# EAGLE design test1 (EAGLE 7.3.0)
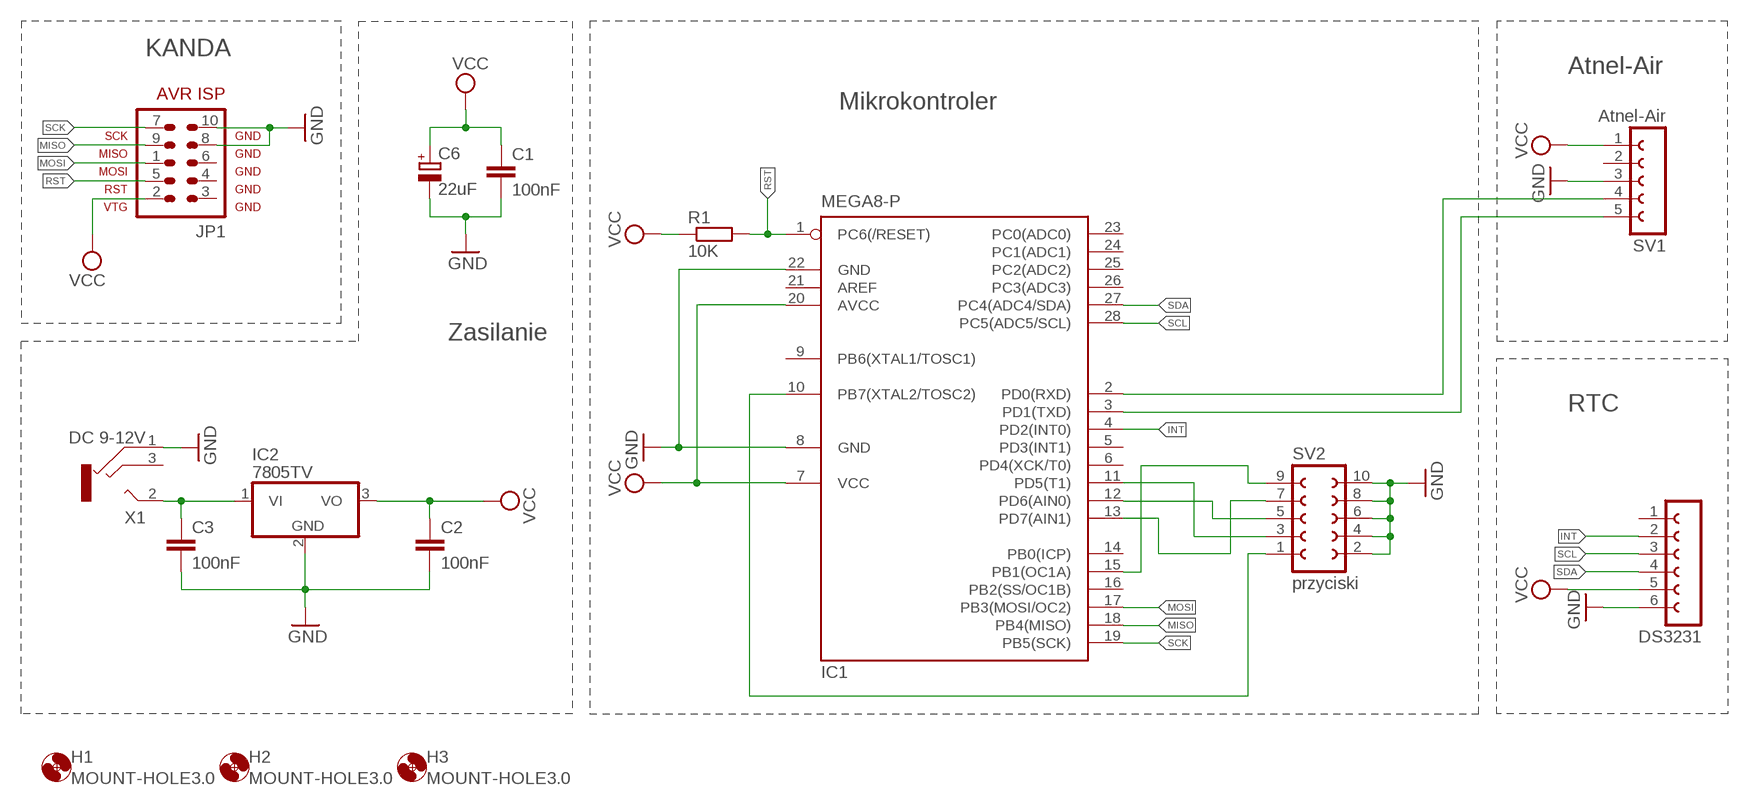
[diagram p0: schematic, sheet 1]

## Parts
C1  100nF  C-EU025-024X044  [C025-024X044]
C2  100nF  C-EU025-024X044  [C025-024X044]
C3  100nF  C-EU025-024X044  [C025-024X044]
C6  22uF  CPOL-EUB45181A  [B45181A]
DS3231  FE06-1  [FE06]
H1  MOUNT-HOLE3.0  [3,0]
H2  MOUNT-HOLE3.0  [3,0]
H3  MOUNT-HOLE3.0  [3,0]
IC1  MEGA8-P  [DIL28-3]
IC2  7805TV  [TO220V]
JP1  AVR-ISP-10  [AVR-ISP-10]
R1  10K  R-EU_0204/2V  [0204V]
SV1  Atnel-Air  FE05-1  [FE05-1]
SV2  przyciski  FE05-2  [FE05-2]
X1  DC 9-12V  1501_04  [1501_05]

## Nets
GND: C1.2 C2.2 C3.2 C6.- DS3231.6 IC1.8(GND) IC1.22(GND) IC2.2(GND) JP1.8 JP1.10 SV1.3 SV2.2 SV2.4 SV2.6 SV2.8 SV2.10 X1.1
INT: DS3231.2 IC1.4(PD2(INT0))
MISO: IC1.18(PB4(MISO)) JP1.9
MOSI: IC1.17(PB3(MOSI/OC2)) JP1.1
N$1: IC1.2(PD0(RXD)) SV1.4
N$2: IC1.3(PD1(TXD)) SV1.5
N$3: IC1.10(PB7(XTAL2/TOSC2)) SV2.1
N$4: IC1.13(PD7(AIN1)) SV2.7
N$5: IC1.12(PD6(AIN0)) SV2.5
N$6: C3.1 IC2.1(VI) X1.2
N$7: IC1.15(PB1(OC1A)) SV2.9
N$8: IC1.11(PD5(T1)) SV2.3
RST: IC1.1(PC6(/RESET)) JP1.5 R1.2
SCK: IC1.19(PB5(SCK)) JP1.7
SCL: DS3231.3 IC1.28(PC5(ADC5/SCL))
SDA: DS3231.4 IC1.27(PC4(ADC4/SDA))
VCC: C1.1 C2.1 C6.+ DS3231.5 IC1.7(VCC) IC1.20(AVCC) IC2.3(VO) JP1.2 R1.1 SV1.1
Unconnected: DS3231.1 IC1.5(PD3(INT1)) IC1.6(PD4(XCK/T0)) IC1.9(PB6(XTAL1/TOSC1)) IC1.14(PB0(ICP)) IC1.16(PB2(SS/OC1B)) IC1.21(AREF) IC1.23(PC0(ADC0)) IC1.24(PC1(ADC1)) IC1.25(PC2(ADC2)) IC1.26(PC3(ADC3)) JP1.3 JP1.4 JP1.6 SV1.2 X1.3

## Notes on the sheet
- KANDA
- Atnel-Air
- Mikrokontroler
- Zasilanie
- RTC

## Library data of the parts
C1-C3 = rcl:C-EU: CAPACITOR, European symbol
C6 = rcl:CPOL-EU: POLARIZED CAPACITOR, European symbol
DS3231 = con-lsta:FE06-1: FEMALE HEADER; OC_FARNELL: unknown; OC_NEWARK: unknown
H1-H3 = holes:MOUNT-HOLE: MOUNTING HOLE with drill center marker
IC1 = atmel:MEGA8-P: MICROCONTROLLER 8 Kbytes FLASH, 1 kbytes SRAM, 512 bytes EEPROM, USART, 4-channel 10 bit ADC, 2-channel 8 bit ADC Pin compatible with Atmega48, ATMega88, ATMega168 Source: avr.lbr; OC_FARNELL: unknown; OC_NEWARK: unknown
IC2 = linear:78*: Positive VOLTAGE REGULATOR Source: http://cache.national.com/ds/LM/LM78L05.pdf http://www.fairchildsemi.com/ds/LM/LM7805.pdf
JP1 = avr-5:AVR-ISP-10: AVR ISP-10 Serial Programming Header
R1 = resistor:R-EU_: RESISTOR, European symbol
SV1 = con-lsta:FE05-1: FEMALE HEADER; OC_FARNELL: unknown; OC_NEWARK: unknown
SV2 = con-lsta:FE05-2: FEMALE HEADER; OC_FARNELL: unknown; OC_NEWARK: unknown
X1 = con-lumberg:1501_0*: Jack connectors according to JISC 6560, 2.5 mm Klinkensteckverbinder nach JISC 6560, 2,5 mm Source: http://www.lumberg.com/Produkte/PDFs/1501_05.pdfedit 1501_03 http://www.lumberg.com/Produkte/PDFs/1501_06.pdf; OC_FARNELL: 1216977; OC_NEWARK: unknown

## Board
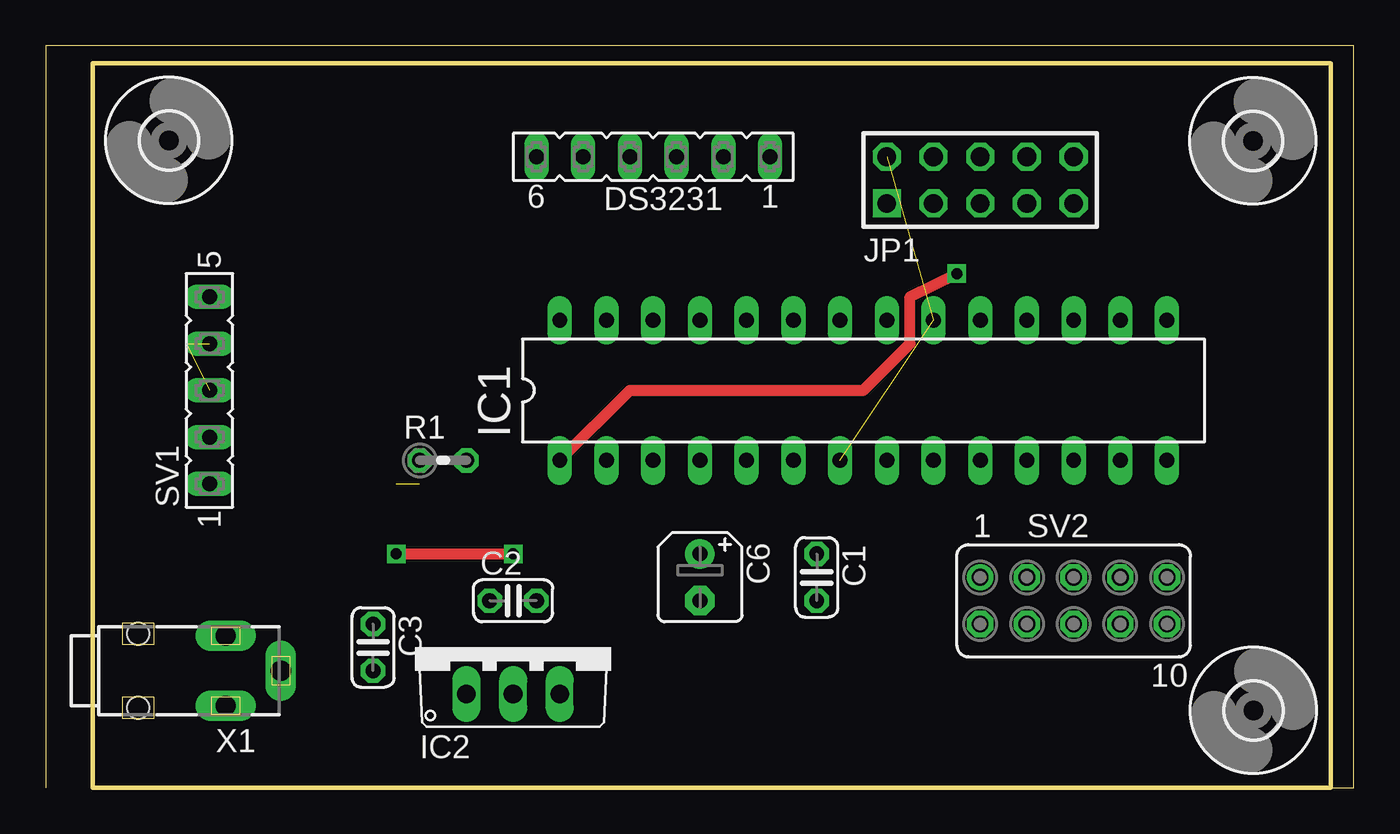
[diagram p1: board, top side]
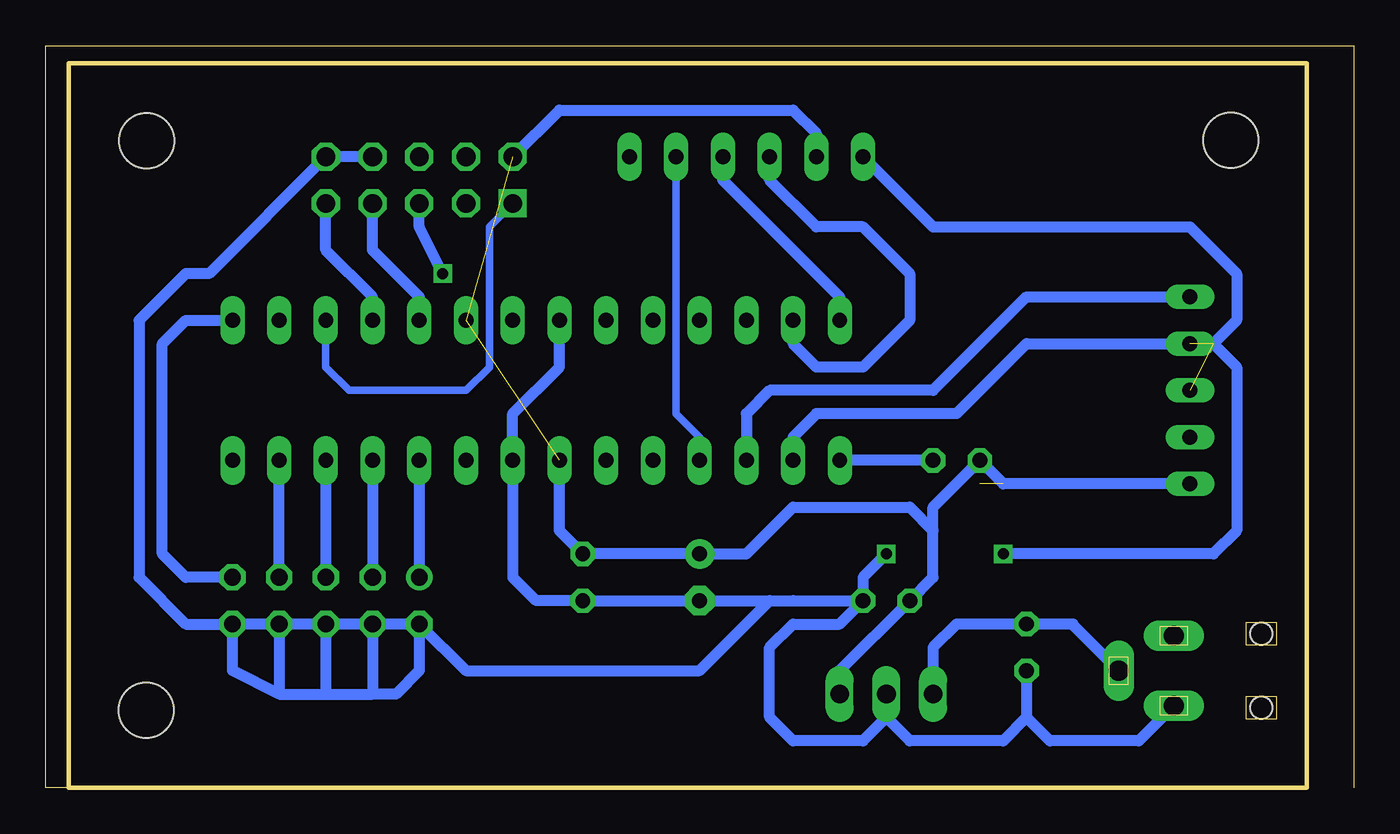
[diagram p2: board, bottom side, seen from below]

Size 71.1 x 40.31 mm. Coordinates in mm from the lower left corner, seen from the top.
Outline: 63.5,0 69.85,0
Outline: 69.85,0 71.1,0 71.1,40.31 0,40.31 0,0
Outline: 69.85,0 2.54,0 2.54,39.37 69.85,39.37 69.85,0
Copper layers (1*16): Top 0.035mm / dielectric 1.5mm / Bottom 0.035mm
Design rules "default": minimum track width 10mil, minimum drill 24mil, track to track 8mil, track to pad 8mil, pad to pad 8mil, via to via 8mil, smd to smd 8mil, copper to edge 40mil, drill to drill 8mil, minimum pad ring 10mil, minimum via ring 8mil, stop-mask expansion 4mil, vias tented up to drill 0mil, thermal gap 10mil

### Footprints (pad centres in the part's own frame; a part is rotated, then mirrored left to right if it is on the bottom)
C025-024X044 = drill 0.813 octagon: 1 -1.27,0; 2 1.27,0
B45181A = drill 0.813 pad 1.6: + -1.27,0 | drill 0.813 pad 1.6 octagon: - 1.27,0
FE06 = drill 0.813 long: 1 -6.35,0; 2 -3.81,0; 3 -1.27,0; 4 1.27,0; 5 3.81,0; 6 6.35,0
3,0 = hole 3: 0,0
DIL28-3 = drill 0.813 long: 1 -16.51,-3.81; 2 -13.97,-3.81; 3 -11.43,-3.81; 4 -8.89,-3.81; 5 -6.35,-3.81; 6 -3.81,-3.81; 7 -1.27,-3.81; 8 1.27,-3.81; 9 3.81,-3.81; 10 6.35,-3.81; 11 8.89,-3.81; 12 11.43,-3.81; 13 13.97,-3.81; 14 16.51,-3.81; 15 16.51,3.81; 16 13.97,3.81; 17 11.43,3.81; 18 8.89,3.81; 19 6.35,3.81; 20 3.81,3.81; 21 1.27,3.81; 22 -1.27,3.81; 23 -3.81,3.81; 24 -6.35,3.81; 25 -8.89,3.81; 26 -11.43,3.81; 27 -13.97,3.81; 28 -16.51,3.81
TO220V = drill 1.016 long: 1 -2.54,-2.54; 2 0,-2.54; 3 2.54,-2.54
AVR-ISP-10 = drill 1.016 square: 1 -5.08,-1.27 | drill 1.016 octagon: 2 -5.08,1.27; 3 -2.54,-1.27; 4 -2.54,1.27; 5 0,-1.27; 6 0,1.27; 7 2.54,-1.27; 8 2.54,1.27; 9 5.08,-1.27; 10 5.08,1.27
0204V = drill 0.813 octagon: 1 -1.27,0; 2 1.27,0
FE05-1 = drill 0.813 long: 1 -5.08,0; 2 -2.54,0; 3 0,0; 4 2.54,0; 5 5.08,0
FE05-2 = drill 0.914: 1 -5.08,1.27 | drill 0.914 octagon: 2 -5.08,-1.27; 3 -2.54,1.27; 4 -2.54,-1.27; 5 0,1.27; 6 0,-1.27; 7 2.54,1.27; 8 2.54,-1.27; 9 5.08,1.27; 10 5.08,-1.27
1501_05 = drill 1.1 pad 1.4 long: 1 -1.9,-8.5; 2 0,-11.5; 3 1.9,-8.5 | hole 1.2: -2,-3.75; 2,-3.75

### Placement (x,y rotation side)
C1  41.91,11.43 270 top
C2  25.4,10.16 0 top
C3  17.78,7.62 270 top
C6  35.56,11.43 270 top
DS3231  33.02,34.29 180 top
H1  6.68,35.18 0 top
H2  65.63,35.15 0 top
H3  65.66,4.19 0 top
IC1  44.45,21.59 0 top
IC2  25.4,7.62 0 top
JP1  50.8,33.02 0 top
R1  21.59,17.78 0 top
SV1  8.89,21.59 90 top
SV2  55.88,10.16 0 top
X1  1.27,6.35 90 top

### Tracks (layer width: path | path; a pad name or v marks a point on that pad's centre or on a via)
GND  (via drill 0.6)  (1 unrouted)
  Top 0.61: v19.05,12.7 v25.4,12.7
  Bottom 0.61: 58.42,5.08 55.88,5.08 | 55.88,5.08 53.34,5.08 | SV2.8 58.42,5.08 | SV2.6 55.88,5.08 | SV2.4 53.34,5.08 | X1.1 11.68,2.54 16.51,2.54 17.78,3.81 | C3.2 17.78,3.81 | 17.78,3.81 19.05,2.54 24.13,2.54 25.4,3.81 | 25.4,3.81 IC2.2 | 25.4,3.81 26.67,2.54 30.48,2.54 31.75,3.81 31.75,7.62 30.48,8.89 27.94,8.89 C2.2 | v25.4,12.7 26.67,11.43 C2.2 | DS3231.6 22.86,30.48 8.89,30.48 6.35,27.94 6.35,25.4 7.62,24.13 6.35,22.86 6.35,13.97 7.62,12.7 v19.05,12.7 | IC1.22 43.18,22.86 45.72,20.32 IC1.8 45.72,11.43 44.45,10.16 C1.2 C6.- 31.75,10.16 | C2.2 30.48,10.16 31.75,10.16 | 58.42,5.08 60.96,6.35 SV2.10 | JP1.8 JP1.10 62.23,27.94 63.5,27.94 66.04,25.4 66.04,11.43 63.5,8.89 SV2.10 | SV2.2 50.8,6.35 52.07,5.08 53.34,5.08 | SV2.2 SV2.10 | SV2.2 48.26,6.35 35.56,6.35 31.75,10.16
INT
  Bottom 0.406: IC1.4 35.56,19.05 36.83,20.32 DS3231.2
MISO
  Bottom 0.61: IC1.18 53.34,26.67 55.88,29.21 JP1.9
MOSI
  Bottom 0.406: IC1.17 55.88,22.86 54.61,21.59 48.26,21.59 46.99,22.86 46.99,30.48 JP1.1
N$1  (1 unrouted)
  Bottom 0.61: IC1.2 30.48,19.05 29.21,20.32 21.59,20.32 17.78,24.13 7.62,24.13
N$2
  Bottom 0.61: IC1.3 33.02,20.32 31.75,21.59 22.86,21.59 17.78,26.67 SV1.5
N$3
  Bottom 0.61: IC1.10 SV2.1
N$4
  Bottom 0.61: SV2.7 IC1.13
N$5
  Bottom 0.61: IC1.12 SV2.5
N$6
  Bottom 0.61: X1.2 15.24,8.82 15.24,8.89 C3.1 21.59,8.89 22.86,7.62 IC2.1
N$7
  Bottom 0.61: SV2.9 63.5,11.43 64.77,12.7 64.77,24.13 63.5,25.4 IC1.15
N$8
  Bottom 0.61: IC1.11 SV2.3
RST  (via drill 0.6)
  Top 0.61: IC1.1 31.75,21.59 44.45,21.59 46.99,24.13 46.99,26.67 v49.53,27.94
  Bottom 0.61: R1.2 IC1.1 | v49.53,27.94 50.8,30.48 JP1.5
SCK
  Bottom 0.61: IC1.19 50.8,26.67 53.34,29.21 JP1.7
SCL
  Bottom 0.61: IC1.28 27.94,26.67 34.29,33.02 DS3231.3
SDA
  Bottom 0.61: IC1.27 30.48,24.13 29.21,22.86 26.67,22.86 24.13,25.4 24.13,27.94 26.67,30.48 29.21,30.48 31.75,33.02 DS3231.4
VCC  (3 unrouted)
  Bottom 0.61: IC1.7 43.18,13.97 C1.1 C6.+ 33.02,12.7 30.48,15.24 24.13,15.24 22.86,13.97 | IC2.3 27.94,6.35 C2.1 22.86,11.43 22.86,13.97 | 22.86,13.97 22.86,15.24 R1.1 19.05,16.51 SV1.1 | JP1.2 43.18,36.83 30.48,36.83 29.21,35.56 DS3231.5